# EAGLE design 3-5 AAA stepup (EAGLE 5.11)
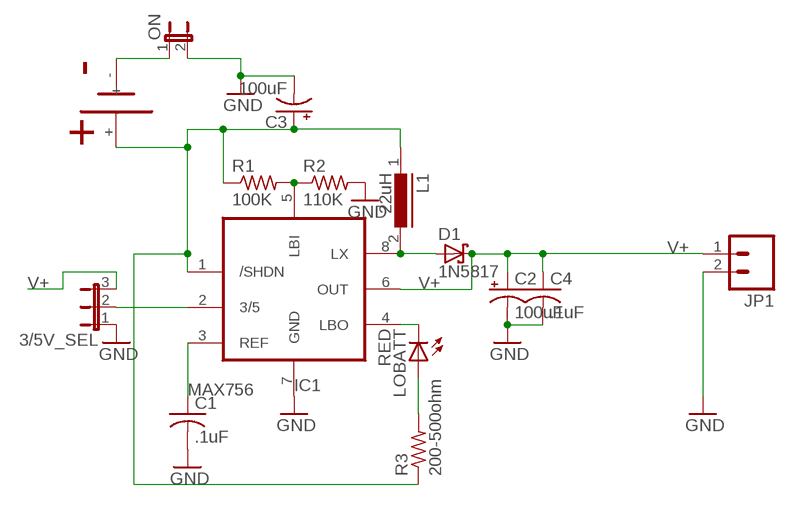
[diagram p0: schematic, sheet 1]

## Parts
3/5V_SEL  JP2E  [JP2]
C1  .1uF  C-US025-024X044  [C025-024X044]
C2  100uF  CPOL-USE2.5-5  [E2,5-5]
C3  100uF  CPOL-USE2.5-5  [E2,5-5]
C4  .1uF  C-US025-024X044  [C025-024X044]
D1  1N5817  SCHOTTKY-DIODEDO41  [DO41-10]
IC1  MAX756  MAX756CPA  [DIL08]
JP1  M02PTH  [1X02]
L1  22uH  DR73  [DR73]
LOBATT  RED  LED3MM  [LED3MM]
ON  JP1E  [JP1]
R1  100K  R-US_0204/2V  [0204V]
R2  110K  R-US_0207/2V  [0207/2V]
R3  200-500ohm  R-US_0204/2V  [0204V]
U$1  AAA-BATTERY-HOLDER  [AAA-BATTERY-HOLDER]

## Nets
GND: 3/5V_SEL.1 C1.2 C2.- C3.- C4.2 IC1.7(GND) JP1.2 ON.2 R2.2
N$1: C1.1 IC1.3(REF)
N$2: C3.+ IC1.1(/SHDN) L1.1 R1.1 R3.1 U$1.+
N$3: ON.1 U$1.-
N$4: 3/5V_SEL.2 IC1.2(3/5)
N$5: D1.A IC1.8(LX) L1.2
N$6: IC1.4(LBO) LOBATT.K(C)
N$9: IC1.5(LBI) R1.2 R2.1
N$10: LOBATT.A R3.2
V+: 3/5V_SEL.3 C2.+ C4.1 D1.C IC1.6(OUT) JP1.1

## Library data of the parts
3/5V_SEL = jumper:JP2E: JUMPER
C1 C4 = rcl-ez:C-US: CAPACITOR, American symbol
C2 C3 = rcl-ez:CPOL-US: POLARIZED CAPACITOR, American symbol
D1 = usbbuck:SCHOTTKY-DIODE: Schottky Diode
IC1 = usbbuck:MAX756
JP1 = SparkFun:M02: Header 2 Standard 2-pin 0.1" header. Use with straight break away headers (SKU : PRT-00116), right angle break away headers (PRT-00553), swiss pins (PRT-00743), machine pins (PRT-00117), and female headers (PRT-00115). Molex polarized connector foot print use with SKU : PRT-08233 with associated crimp pins and housings.
L1 = inductors:DR73: High Power Density, High Efficiency, Shielded Inductors Source: coiltronics_dr_series.pdf
LOBATT = led:LED: LED OSRAM: - CHIPLED LG R971, LG N971, LY N971, LG Q971, LY Q971, LO R971, LY R971 LH N974, LH R974 LS Q976, LO Q976, LY Q976 LO Q996 - Hyper CHIPLED LW Q18S LB Q993, LB Q99A, LB R99A - SideLED LS A670, LO A670, LY A670, LG A670, LP A670 LB A673, LV A673, LT A673, LW A673 LH A674 LY A675 LS A676, LA A676, LO A676, LY A676, LW A676 LS A679, LY A679, LG A679 - Hyper Micro SIDELED® LS Y876, LA Y876, LO Y876, LY Y876 LT Y87S - SmartLED LW L88C, LW L88S LB L89C, LB L89S, LG L890 LS L89K, LO L89K, LY L89K LS L896, LA L896, LO L896, LY L896 - TOPLED LS T670, LO T670, LY T670, LG T670, LP T670 LSG T670, LSP T670, LSY T670, LOP T670, LYG T670 LG T671, LOG T671, LSG T671 LB T673, LV T673, LT T673, LW T673 LH T674 LS T676, LA T676, LO T676, LY T676, LB T676, LH T676, LSB T676, LW T676 LB T67C, LV T67C, LT T67C, LS T67K, LO T67K, LY T67K, LW E67C LS E67B, LA E67B, LO E67B, LY E67B, LB E67C, LV E67C, LT E67C LW T67C LS T679, LY T679, LG T679 LS T770, LO T770, LY T770, LG T770, LP T770 LB T773, LV T773, LT T773, LW T773 LH T774 LS E675, LA E675, LY E675, LS T675 LS T776, LA T776, LO T776, LY T776, LB T776 LHGB T686 LT T68C, LB T68C - Hyper Mini TOPLED® LB M676 - Mini TOPLED Santana® LG M470 LS M47K, LO M47K, LY M47K Source: http://www.osram.convergy.de LUXEON: - LUMILED® LXK2-PW12-R00, LXK2-PW12-S00, LXK2-PW14-U00, LXK2-PW14-V00 LXK2-PM12-R00, LXK2-PM12-S00, LXK2-PM14-U00 LXK2-PE12-Q00, LXK2-PE12-R00, LXK2-PE12-S00, LXK2-PE14-T00, LXK2-PE14-U00 LXK2-PB12-K00, LXK2-PB12-L00, LXK2-PB12-M00, LXK2-PB14-N00, LXK2-PB14-P00, LXK2-PB14-Q00 LXK2-PR12-L00, LXK2-PR12-M00, LXK2-PR14-Q00, LXK2-PR14-R00 LXK2-PD12-Q00, LXK2-PD12-R00, LXK2-PD12-S00 LXK2-PH12-R00, LXK2-PH12-S00 LXK2-PL12-P00, LXK2-PL12-Q00, LXK2-PL12-R00 Source: www.luxeon.com KINGBRIGHT: KA-3528ASYC Source: www.kingbright.com
ON = jumper:JP1E: JUMPER
R1-R3 = rcl:R-US_: RESISTOR, American symbol
U$1 = MyLib:AAA-BATTERY-HOLDER

## Net classes
0 default: width 0.635 mm

## Board
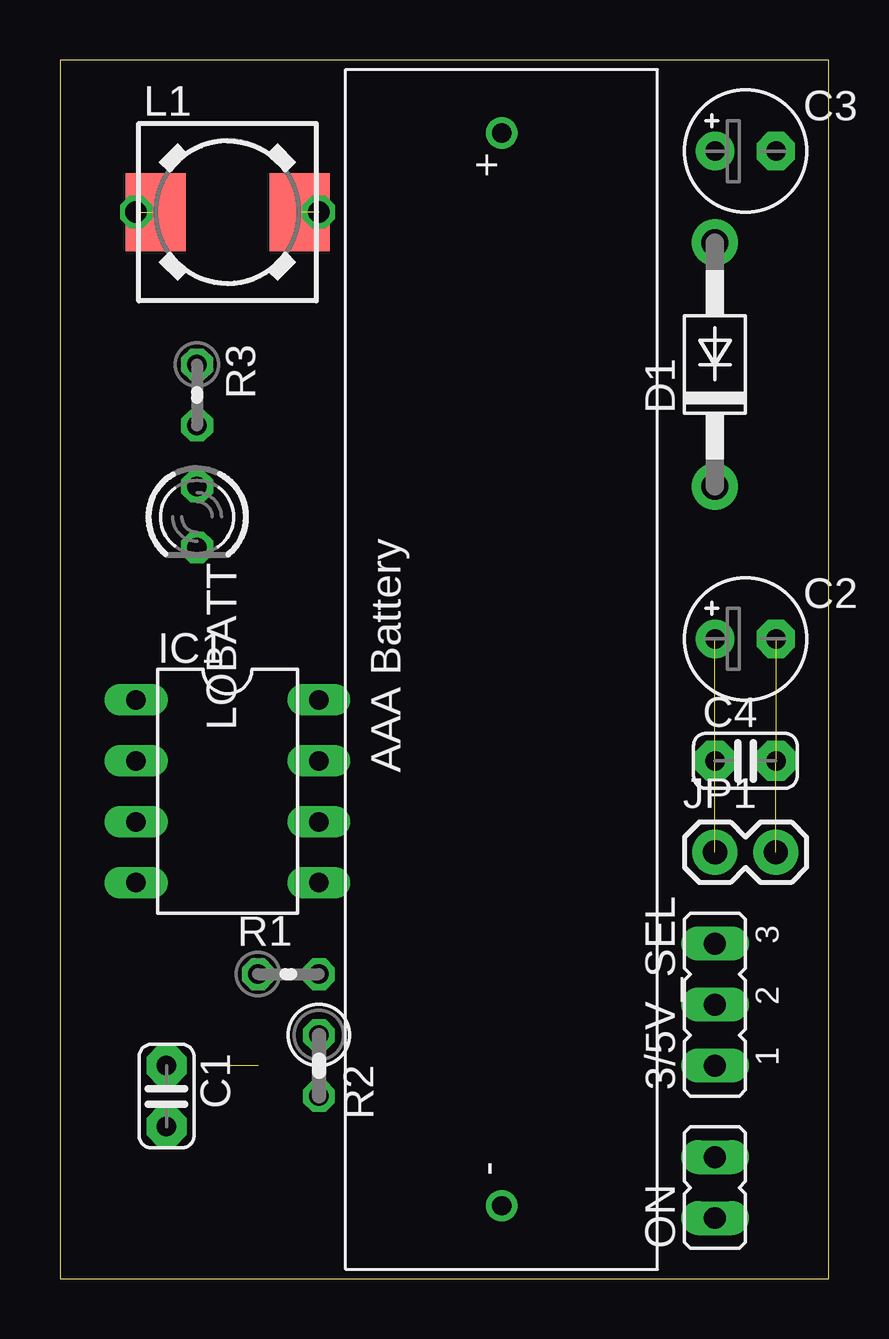
[diagram p1: board, top side]
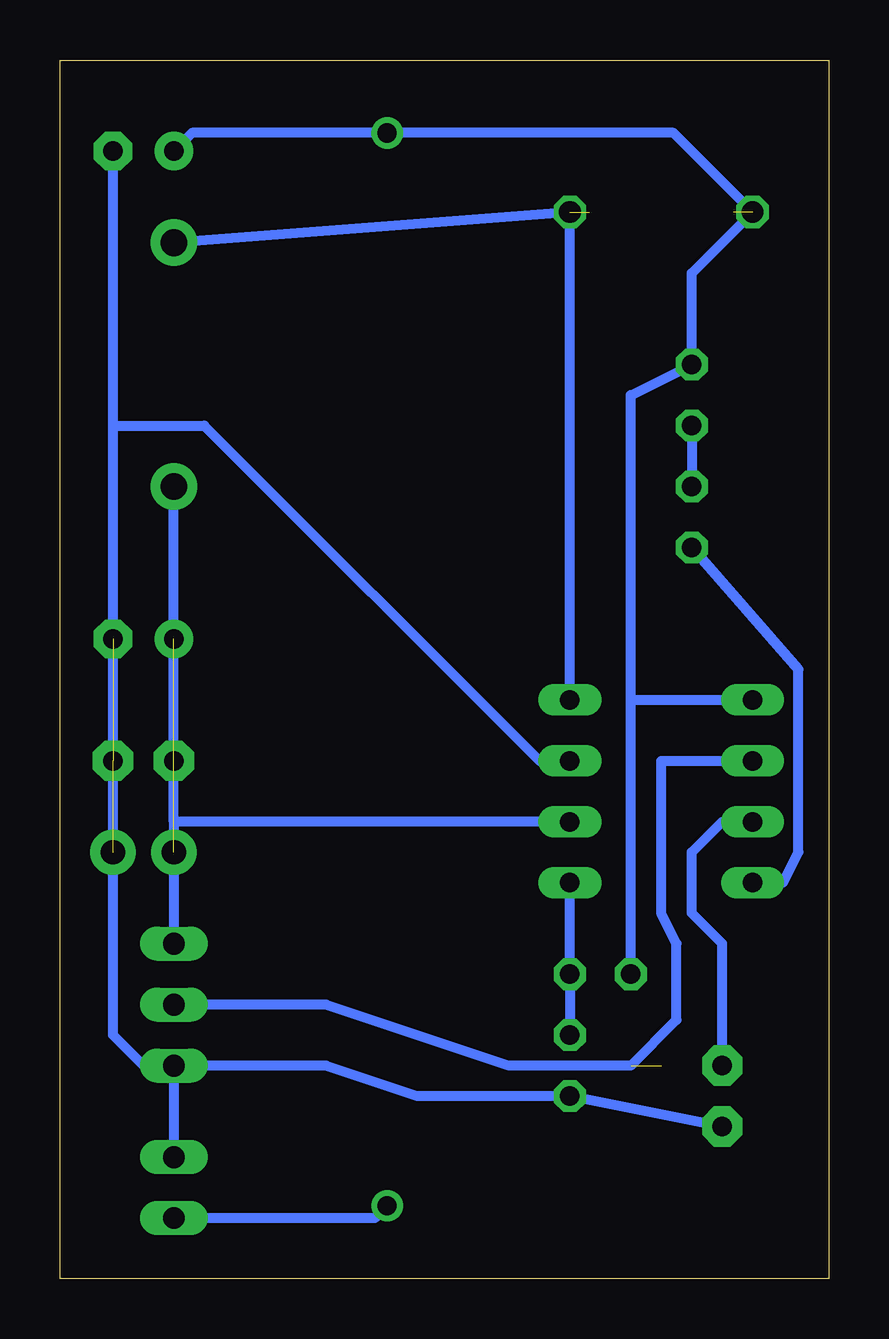
[diagram p2: board, bottom side, seen from below]

Size 32.05 x 50.79 mm. Coordinates in mm from the lower left corner, seen from the top.
Outline: 0,0 32.05,0 32.05,50.79 0,50.79 0,0
Copper layers (1*16): Top 0.035mm / dielectric 1.5mm / Bottom 0.035mm
Design rules "default": minimum track width 10mil, minimum drill 24mil, track to track 8mil, track to pad 8mil, pad to pad 8mil, via to via 8mil, smd to smd 8mil, copper to edge 40mil, drill to drill 8mil, minimum pad ring 10mil, minimum via ring 8mil, stop-mask expansion 4mil, vias tented up to drill 0mil, thermal gap 10mil

### Footprints (pad centres in the part's own frame; a part is rotated, then mirrored left to right if it is on the bottom)
JP2 = drill 0.914 long: 1 -2.54,0; 2 0,0; 3 2.54,0
C025-024X044 = drill 0.813 pad 1.676 octagon: 1 -1.27,0; 2 1.27,0
E2,5-5 = drill 0.813 pad 1.6 round: + -1.27,0 | drill 0.813 pad 1.6 octagon: - 1.27,0
DO41-10 = drill 1.118 pad 1.93 round: A 5.08,0; C -5.08,0
DIL08 = drill 0.813 long: 1 -3.81,-3.81; 2 -1.27,-3.81; 3 1.27,-3.81; 4 3.81,-3.81; 5 3.81,3.81; 6 1.27,3.81; 7 -1.27,3.81; 8 -3.81,3.81
1X02 = drill 1.016 pad 1.88 round: 1 0,0; 2 2.54,0
DR73 = smd 2.5 x 3.25: 1 -3,0; 2 3,0
LED3MM = drill 0.813 octagon: A -1.27,0; K 1.27,0
JP1 = drill 0.914 long: 1 0,-1.27; 2 0,1.27
0204V = drill 0.813 octagon: 1 -1.27,0; 2 1.27,0
0207/2V = drill 0.813 octagon: 1 -1.27,0; 2 1.27,0
AAA-BATTERY-HOLDER = drill 0.8 round: + 22.35,0; - -22.35,0

### Placement (x,y rotation side)
3/5V_SEL  27.3,11.43 90 top
C1  4.45,7.62 270 top
C2  28.57,26.67 0 top
C3  28.57,46.99 0 top
C4  28.57,21.59 0 top
D1  27.3,38.1 90 top
IC1  6.98,20.32 270 top
JP1  27.3,17.78 0 top
L1  6.98,44.45 0 top
LOBATT  5.71,31.75 270 top
ON  27.3,3.81 0 top
R1  9.52,12.7 0 top
R2  10.8,8.89 270 top
R3  5.71,36.83 270 top
U$1  18.41,25.4 90 top

### Tracks (layer width: path | path; a pad name or v marks a point on that pad's centre or on a via)
GND  (2 unrouted)
  Bottom 0.406: 3/5V_SEL.1 28.57,8.89 29.84,10.16 C2.- 29.84,35.56 | IC1.7 12.06,21.59 26.03,35.56 29.84,35.56 | 3/5V_SEL.1 20.95,8.89 17.14,7.62 R2.2 C1.2 | 3/5V_SEL.1 ON.2 | 29.84,35.56 C3.-
N$1
  Bottom 0.406: C1.1 4.45,13.97 5.71,15.24 5.71,17.78 4.45,19.05 IC1.3
N$2  (via drill 0.9)  (1 unrouted)
  Bottom 0.406: C3.+ 26.55,47.75 U$1.+ 6.48,47.75 v3.17,44.45 5.71,41.91 R3.1 8.25,36.83 8.25,24.13 | 8.25,24.13 IC1.1 | R1.1 8.25,24.13
N$3
  Bottom 0.406: ON.1 18.92,2.54 U$1.-
N$4  (1 unrouted)
  Bottom 0.406: 3/5V_SEL.2 20.95,11.43 13.34,8.89 8.25,8.89 6.35,10.79 6.35,13.97 6.98,15.24 6.98,21.59 IC1.2
N$5  (via drill 0.9)  (1 unrouted)
  Bottom 0.406: D1.A v10.8,44.45 IC1.8
N$6
  Bottom 0.406: LOBATT.K 1.27,25.4 1.27,17.78 1.91,16.51 IC1.4
N$9
  Bottom 0.406: IC1.5 R1.2 R2.1
N$10
  Bottom 0.406: R3.2 LOBATT.A
V+  (3 unrouted)
  Bottom 0.406: 27.3,19.05 3/5V_SEL.3 | 27.3,19.05 D1.C | IC1.6 27.3,19.05